# Altium project BLEFloor.PrjPcb
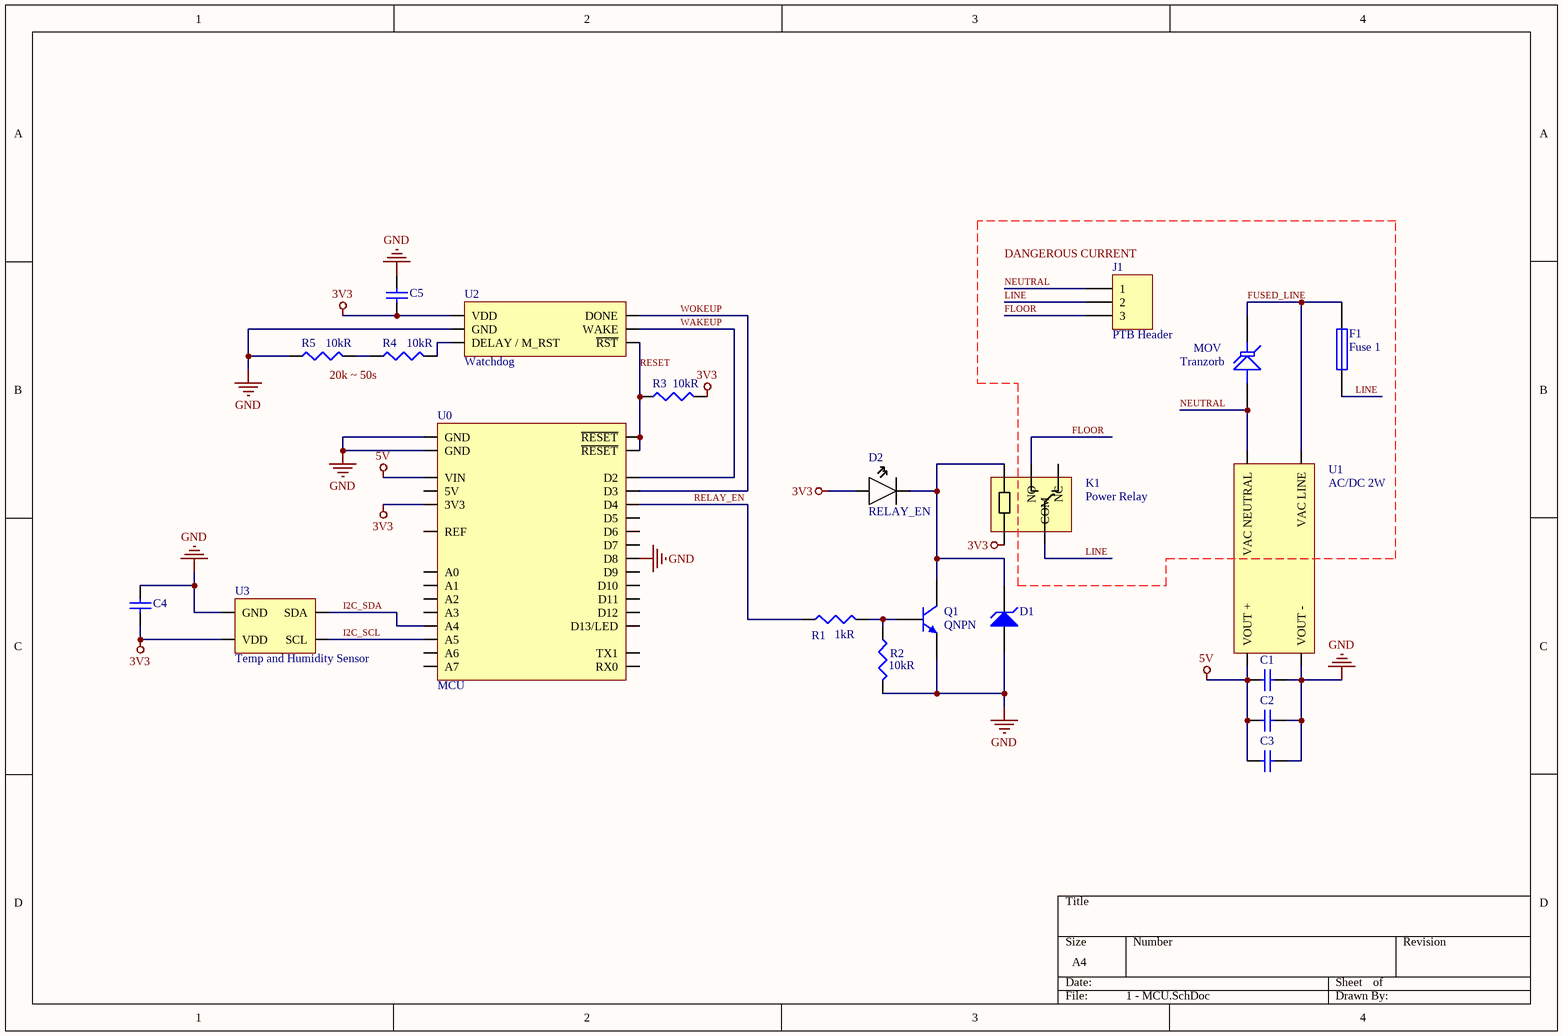
[diagram p0: 1 - MCU.SchDoc]
1 sheet, 21 parts. Net scope: global (net labels, ports and power ports of the same name join across sheets).
Board file: BLEFloor.PcbDoc

## Sheet 1 - MCU.SchDoc
size A4

### Parts
C1  4.7uF  [SMD_1206_C_SMALL]  (value not drawn)
C2  4.7uF  [SMD_1206_C_SMALL]  (value not drawn)
C3  Cap Semi  [SMD_0805_C]  (value not drawn)
C4  Cap Semi  [SMD_0805_C]  (value not drawn)
C5  Cap Semi  [SMD_0805_C]  (value not drawn)
D1  D Zener  [SOD323 / SC-76]  (value not drawn)
D2  RELAY_EN  [LED0603]
F1  Fuse 1  [Bourns SF-3812TL]
J1  PTB Header  [TBL005A-500-03GY]
K1  Power Relay  [G5LE-14]
MOV  Tranzorb  [MOV_14mm_7.5]
Q1  QNPN  [SOT-23B_N]
R1  Resistance: 1kR  [SMD_0603_R]  (hidden comment: Res3)
R2  Resistance: 10kR  [SMD_0603_R]  (hidden comment: Res3)
R3  Resistance: 10kR  [SMD_0603_R]  (hidden comment: Res3)
R4  Resistance: 10kR  [SMD_0603_R]  (hidden comment: Res3)
R5  Resistance: 10kR  [SMD_0603_R]  (hidden comment: Res3)
U0  MCU  [BLENano33IoT]
U1  AC/DC 2W  [RAC02-GA]
U2  Watchdog  [SOT23-6_L]
U3  Temp and Humidity Sensor  [3x3 6pin DFN]

### Nets
3V3: C4.2 C5.2 D2.A(ANODE) K1.5(COILB) R3.2 U0.2(3V3) U2.1(VDD) U3.5(VDD)
5V: C1.2 C2.2 C3.2 U0.15(VIN) U1.4(VOUT_+)
GND: C1.1 C2.1 C3.1 C4.1 C5.1 D1.1(A) Q1.3(E) R2.2 R5.1 U0.14(GND) U0.19(GND) U0.26(D8) U1.3(VOUT_-) U2.2(GND) U3.2(GND)
FLOOR: J1.3 K1.3(NO)
FUSED_LINE: F1.2 MOV.2(K) U1.1(VAC_LINE)
I2C_SCL: U0.9(A5) U3.6(SCL)
I2C_SDA: U0.8(A4) U3.1(SDA)
LINE: F1.1 J1.2 K1.1(COM)
NEUTRAL: J1.1 MOV.1(A) U1.2(VAC_NEUTRAL)
RELAY_EN: R1.1 U0.22(D4)
RESET: R3.1 U0.13(~{RESET}) U0.18(~{RESET}) U2.6(~{RST})
WAKEUP: U0.20(D2) U2.5(WAKE)
WOKEUP: U0.21(D3) U2.4(DONE)
NetD1_2: D1.2(K) D2.C(CATHODE) K1.2(COILA) Q1.1(C)
NetQ1_2: Q1.2(B) R1.2 R2.1
NetR4_1: R4.1 R5.2
NetR4_2: R4.2 U2.3(DELAY_/_M_RST)

Not connected (* = marked no-connect by the designer): K1 4(NC); U0 1(D13/LED) 3(REF) 4(A0) 5(A1) 6(A2) 7(A3) 10(A6) 11(A7) 12(5V) 16(TX1) 17(RX0) 23(D5) 24(D6) 25(D7) 27(D9) 28(D10) 29(D11) 30(D12)

### Notes on the sheet
- (near J1) DANGEROUS CURRENT
- 20k ~ 50s

### Library data of the parts
C1 C2 = Cap Semi: Capacitor (Semiconductor SIM Model); Manufacturer: Murata; Manufacturer Part Number: GCM31CC71H475MA03K; Supplier 1: Mouser; Supplier Part Number 1: 81-GCM31CC71H475MA3K; Stock 1: 57295; Pricing 1: 1=0.63, 10=0.448, 50=0.448, 100=0.295, 1000=0.197, 10000=0.148 (USD)
C3-C5 = Cap Semi: Manufacturer: Kyocera AVX; Manufacturer Part Number: 08055C104K4Z2A; Dielectric Material: Ceramic; Tolerance: 10%; Capacitance: 100nF; Voltage Rating: 50V; Dielectric: X7R; Temperature Coefficient: 30ppm/°C; Supplier 1: Mouser; Supplier Part Number 1: 581-08055C104K4Z2A; Stock 1: 4069; Pricing 1: 1=0.18, 10=0.137, 50=0.137, 100=0.064, 1000=0.038, 10000=0.028 (USD); Mount: Surface Mount; Case/Package: 0805; Number of Pins: 2; Case Code (Imperial): 0805; Case Code (Metric): 2012; Contact Plating: Tin,Matte; Min Operating Temperature: -55°C; Max Operating Temperature: 125°C; Packaging: Tape and Reel; Package Quantity: 1; Termination: SMD/SMT; Voltage Rating (DC): 50V; Construction: Flat; Voltage: 50V; Series: FLEXITERM®; Features: Soft Termination; Length: 2.01mm; Width: 1.25mm; Height: 0.94mm; Thickness: 0.037inch; Depth: 1.25mm; Ratings: AEC-Q200; Radiation Hardening: No; REACH SVHC: No SVHC; Lead Free: Lead Free; ComponentLink1URL: http://catalogs.avx.com/SurfaceMount.pdf?src-supplier=Digi-Key; ComponentLink1Description: http://catalogs.avx.com/SurfaceMount.pdf?src-supplier=Digi-Key; ComponentLink2URL: http://uk.rs-online.com/webdocs/13ec/0900766b813ece3d.pdf?src-supplier=RSComponents; ComponentLink2Description: http://uk.rs-online.com/webdocs/13ec/0900766b813ece3d.pdf?src-supplier=RSComponents; ComponentLink3URL: http://www.farnell.com/datasheets/630895.pdf?src-supplier=Element14; ComponentLink3Description: http://www.farnell.com/datasheets/630895.pdf?src-supplier=Element14; ComponentLink4URL: http://www.avx.com/docs/Catalogs/cauto.pdf?src-supplier=Future+Electronics; ComponentLink4Description: http://www.avx.com/docs/Catalogs/cauto.pdf?src-supplier=Future+Electronics; ComponentLink5URL: https://www.avx.com/docs/Catalogs/flexiterm.pdf?src-supplier=Avnet; ComponentLink5Description: https://www.avx.com/docs/Catalogs/flexiterm.pdf?src-supplier=Avnet; ComponentLink6URL: http://www.farnell.com/datasheets/2237835.pdf?src-supplier=Element14; ComponentLink6Description: http://www.farnell.com/datasheets/2237835.pdf?src-supplier=Element14
D1 = D Zener: TVS DIODE 3.3VWM 13VC; pin to pad: 1>2 2>1; Manufacturer: Nexperia; Manufacturer Part Number: BZX384-B3V3,115; Supplier 1: Mouser; Supplier Part Number 1: 771-BZX384-B3V3-T/R; Stock 1: 20536; Pricing 1: 1=0.2, 10=0.127, 50=0.127, 100=0.065, 1000=0.039, 10000=0.025 (USD); ComponentLink1URL: http://www.farnell.com/datasheets/2174101.pdf?src-supplier=Farnell; ComponentLink1Description: http://www.farnell.com/datasheets/2174101.pdf?src-supplier=Farnell; ComponentLink2URL: https://assets.nexperia.com/documents/data-sheet/BZX384_SERIES.pdf?src-supplier=Digi-Key; ComponentLink2Description: https://assets.nexperia.com/documents/data-sheet/BZX384_SERIES.pdf?src-supplier=Digi-Key
D2 = LED: Manufacturer: Stanley Electric; Manufacturer Part Number: SJW1151CKS-100-TR; Color: Orange; Lens Style: Flat; Luminous Intensity: 280mcd; Forward Voltage: 3.2V; Test Current: 20mA; Viewing Angle: 165°; Lens Size: 0.8mm; Supplier 1: Mouser; Supplier Part Number 1: 327-SJW1151CKS100TR; Stock 1: 7869; Pricing 1: 1=0.6, 10=0.395, 50=0.395, 100=0.258, 1000=0.204, 10000=0.167 (USD); Mount: Surface Mount; Case/Package: 0603; Lens Color: Orange; Case Code (Imperial): 0603; Case Code (Metric): 1608; Packaging: Tape and Reel; Length: 1.6mm; Width: 0.8mm; Height: 0.8mm; ComponentLink1URL: http://www.stanley-components.com/php/downloaddatafile.php?rp=0,SJW1151CKS-100_e.pdf&src-supplier=Digi-Key; ComponentLink1Description: http://www.stanley-components.com/php/downloaddatafile.php?rp=0,SJW1151CKS-100_e.pdf&src-supplier=Digi-Key
F1 = Fuse 1: Fuse; Manufacturer: Bourns; Manufacturer Part Number: SF-3812TL050T-2; Supplier 1: Mouser; Supplier Part Number 1: 652-SF-3812TL050T-2; Stock 1: 4734; Pricing 1: 1=1.47, 10=1.37, 50=1.13, 100=0.961, 1000=0.711, 10000=0.674 (USD)
J1 = Header 3: Header, 3-Pin; Manufacturer: CUI Devices; Manufacturer Part Number: TBL005A-500-03GY-2WT; LatestRevisionDate: 17-Jul-2002; LatestRevisionNote: Re-released for DXP Platform.; Publisher: Altium Limited; Supplier 1: Mouser; Supplier Part Number 1: 490-TBL05A50003GY2WT; Stock 1: 434; Pricing 1: 1=1.11, 10=0.664, 50=0.664, 100=0.558, 1000=0.47, 10000=0.426 (USD)
K1 = Relay, SPDT: Manufacturer: Omron; Manufacturer Part Number: G5LE-14-DC3; Throw Configuration: SPDT; Coil Resistance: 22.5R; Coil Current: 133mA; Operate Time: 10ms; Release Time: 5ms; Coil Power: 400mW; Max Voltage Rating (AC): 250V; Max Voltage Rating (DC): 125V; Relay Type: General Purpose; Coil Type: Non-Latching; Coil Voltage (DC): 3V; Contact Current Rating: 10A; Supplier 1: Mouser; Supplier Part Number 1: 653-G5LE-14DC3; Stock 1: 0; Pricing 1: 1=1.24, 10=1.14, 50=1.14, 100=0.92, 1000=0.865, 10000=0.834 (USD); Mount: Through Hole; Number of Pins: 5; Contact Material: Tin,Silver; Weight: 12g; Min Operating Temperature: -25°C; Max Operating Temperature: 85°C; Package Quantity: 500; Packaging: Tray; Termination: PC Pin; Max Current Rating: 10A; Series: G5LE; Radiation Hardening: No; ComponentLink1URL: https://omronfs.omron.com/en_US/ecb/products/pdf/en-g5le.pdf?src-supplier=Digi-Key; ComponentLink1Description: https://omronfs.omron.com/en_US/ecb/products/pdf/en-g5le.pdf?src-supplier=Digi-Key
MOV = Tranzorb: Transient Voltage Suppression (TVS) Diode; Manufacturer: Bourns; Manufacturer Part Number: MOV-14D391K; Capacitance: 510pF; Max Voltage Rating (DC): 320V; Max Voltage Rating (AC): 250V; Clamping Current: 50A; Varistor Voltage: 390V; Max Surge Current: 4.5kA; Tolerance: 10%; Number of Circuits: 1; Energy: 100J; Clamping Voltage: 650V; Min Varistor Voltage: 351V; Max Varistor Voltage: 429V; Lead/Base Style: Radial; Power Rating: 600mW; Supplier 1: Mouser; Supplier Part Number 1: 652-MOV-14D391K; Stock 1: 3937; Pricing 1: 1=0.47, 10=0.309, 50=0.309, 100=0.252, 1000=0.129, 10000=0.108 (USD); Mount: Through Hole,Radial; Case/Package: Metal; Weight: 0.105822oz; Min Operating Temperature: -40°C; Max Operating Temperature: 85°C; Package Quantity: 1000; Packaging: Bulk; Voltage Rating (AC): 250V; Voltage Rating (DC): 320V; Current Rating: 50A; Voltage Tolerance: 10%; Series: 14D; Diameter: 14mm; Lead Pitch: 7.5mm; Depth: 5mm; Thickness: 5mm; Radiation Hardening: No; REACH SVHC: No SVHC; ComponentLink1URL: https://media.digikey.com/pdf/Data%20Sheets/Bourns%20PDFs/MOV14D_MOV20D_PB.pdf?src-supplier=Digi-Key; ComponentLink1Description: https://media.digikey.com/pdf/Data%20Sheets/Bourns%20PDFs/MOV14D_MOV20D_PB.pdf?src-supplier=Digi-Key; ComponentLink2URL: http://www.bourns.com/data/global/pdfs/MOV14D.pdf?src-supplier=Avnet; ComponentLink2Description: http://www.bourns.com/data/global/pdfs/MOV14D.pdf?src-supplier=Avnet; ComponentLink3URL: http://www.farnell.com/datasheets/1730506.pdf?src-supplier=Element14; ComponentLink3Description: http://www.farnell.com/datasheets/1730506.pdf?src-supplier=Element14
Q1 = QNPN: TRANS NPN MED PWR 400V SOT23F-3; pin to pad: 1>3 2>1 3>2; Manufacturer: Diodes; Manufacturer Part Number: BC847A-7-F; Max Power Dissipation: 300mW; Collector Emitter Voltage (VCEO): 45V; Max Collector Current: 100mA; Transition Frequency: 300MHz; Power Dissipation: 350mW; Collector-emitter Voltage-Max: 600mV; Number of Elements: 1; Collector Base Voltage (VCBO): 50V; Emitter Base Voltage (VEBO): 6V; Element Configuration: Single; hFE Min: 110; Supplier 1: Mouser; Supplier Part Number 1: 621-BC847A-7-F; Stock 1: 3196; Pricing 1: 1=0.19, 10=0.164, 50=0.164, 100=0.073, 1000=0.04, 10000=0.026 (USD); Mount: Surface Mount; Case/Package: SOT-23; Number of Pins: 3; Weight: 0.000282oz; Contact Plating: Tin,Matte; Min Operating Temperature: -65°C; Max Operating Temperature: 150°C; Packaging: Tape and Reel; Collector Emitter Breakdown Voltage: 45V; Max Breakdown Voltage: 45V; Polarity: NPN; Package Quantity: 3000; Frequency: 300MHz; Gain Bandwidth Product: 300MHz; Series: -; Collector Emitter Saturation Voltage: 600mV; Max Frequency: 300MHz; Termination: SMD/SMT; Length: 3.05mm; Width: 1.4mm; Height: 1mm; REACH SVHC: No SVHC; Lead Free: Lead Free; ComponentLink1URL: http://www.diodes.com///datasheets/ds11108.pdf?src-supplier=Avnet+Europe; ComponentLink1Description: http://www.diodes.com///datasheets/ds11108.pdf?src-supplier=Avnet+Europe
R1 = Res3: RES 1K OHM 1/10W 1% 0603 SMD; Manufacturer: Panasonic; Manufacturer Part Number: ERJ3EKF1001V; Temperature Coefficient: 100ppm/°C; Power Rating: 100mW; Voltage Rating: 75V; Supplier 1: Mouser; Supplier Part Number 1: 667-ERJ-3EKF1001V; Stock 1: 482289; Pricing 1: 1=0.1, 10=0.032, 50=0.032, 100=0.013, 1000=0.006, 10000=0.006 (USD); Mount: Surface Mount; Case/Package: 0603; Number of Pins: 2; Contact Plating: Tin; Case Code (Metric): 1608; Case Code (Imperial): 0603; Size Code: 0603; Min Operating Temperature: -55°C; Max Operating Temperature: 155°C; Tolerance: 1%; Resistor Type: Thick Film; Packaging: Tape and Reel; Package Quantity: 5000; Number of Terminations: 2; Termination: SMD/SMT; Max Power Dissipation: 100mW; Voltage Rating (DC): 75V; Features: Automotive AEC-Q200; Series: ERJ; Technology: THICK FILM; Construction: Rectangular; Resistance Tolerance: 1%; Length: 1.6mm; Width: 0.8mm; Height: 0.45mm; Depth: 0.8mm; Radiation Hardening: No; REACH SVHC: No SVHC; Military Standard: Not; Lead Free: Lead Free; ComponentLink1URL: http://www.farnell.com/datasheets/1911175.pdf?src-supplier=Allied+Electronics; ComponentLink1Description: http://www.farnell.com/datasheets/1911175.pdf?src-supplier=Allied+Electronics; ComponentLink2URL: http://industrial.panasonic.com/www-data/pdf/AOA0000/AOA0000CE2.pdf?src-supplier=Future+Electronics; ComponentLink2Description: http://industrial.panasonic.com/www-data/pdf/AOA0000/AOA0000CE2.pdf?src-supplier=Future+Electronics; ComponentLink3URL: http://industrial.panasonic.com/www-data/pdf/AOA0000/AOA0000CE2.pdf?src-supplier=Element14; ComponentLink3Description: http://industrial.panasonic.com/www-data/pdf/AOA0000/AOA0000CE2.pdf?src-supplier=Element14; ComponentLink4URL: http://industrial.panasonic.com/www-data/pdf/AOA0000/AOA0000CE2.pdf?src-supplier=Avnet; ComponentLink4Description: http://industrial.panasonic.com/www-data/pdf/AOA0000/AOA0000CE2.pdf?src-supplier=Avnet; ComponentLink5URL: http://industrial.panasonic.com/cdbs/www-data/pdf/RDA0000/AOA0000C304.pdf?src-supplier=Element14; ComponentLink5Description: http://industrial.panasonic.com/cdbs/www-data/pdf/RDA0000/AOA0000C304.pdf?src-supplier=Element14; ComponentLink6URL: http://www.mouser.com/ds/2/315/AOA0000CE2-37512.pdf?src-supplier=Mouser; ComponentLink6Description: http://www.mouser.com/ds/2/315/AOA0000CE2-37512.pdf?src-supplier=Mouser; ComponentLink7URL: http://www.farnell.com/datasheets/1678782.pdf?src-supplier=Element14; ComponentLink7Description: http://www.farnell.com/datasheets/1678782.pdf?src-supplier=Element14; ComponentLink8URL: http://industrial.panasonic.com/www-data/pdf/AOA0000/AOA0000CE2.pdf?src-supplier=Avnet+Europe; ComponentLink8Description: http://industrial.panasonic.com/www-data/pdf/AOA0000/AOA0000CE2.pdf?src-supplier=Avnet+Europe
R2-R5 = Res3: RES 10K OHM 1/10W 1% 0603 SMD; Manufacturer: Panasonic; Manufacturer Part Number: ERJ-3EKF1002V; Temperature Coefficient: 100ppm/°C; Power Rating: 100mW; Voltage Rating: 75V; Supplier 1: Mouser; Supplier Part Number 1: 667-ERJ-3EKF1002V; Stock 1: 2013101; Pricing 1: 1=0.1, 10=0.04, 50=0.04, 100=0.017, 1000=0.008, 10000=0.003 (USD); Mount: Surface Mount; Case/Package: 0603; Number of Pins: 2; Contact Plating: Tin; Case Code (Metric): 1608; Case Code (Imperial): 0603; Size Code: 0603; Min Operating Temperature: -55°C; Max Operating Temperature: 155°C; Tolerance: 1%; Resistor Type: Thick Film; Packaging: Tape and Reel; Package Quantity: 1; Number of Terminations: 2; Termination: SMD/SMT; Max Power Dissipation: 100mW; Voltage Rating (DC): 75V; Features: Automotive AEC-Q200; Series: ERJ; Technology: THICK FILM; Resistance Tolerance: 1%; Construction: Rectangular; Length: 1.6mm; Width: 0.031inch; Height: 0.45mm; Depth: 0.8mm; Radiation Hardening: No; REACH SVHC: No SVHC; Military Standard: Not; Lead Free: Lead Free; ComponentLink1URL: https://industrial.panasonic.com/cdbs/www-data/pdf/RDA0000/DMA0000COL11.pdf?src-supplier=Avnet+Asia; ComponentLink1Description: https://industrial.panasonic.com/cdbs/www-data/pdf/RDA0000/DMA0000COL11.pdf?src-supplier=Avnet+Asia; ComponentLink2URL: http://www.farnell.com/datasheets/1911175.pdf?src-supplier=Element14; ComponentLink2Description: http://www.farnell.com/datasheets/1911175.pdf?src-supplier=Element14; ComponentLink3URL: https://industrial.panasonic.com/cdbs/www-data/pdf/RDA0000/DMA0000COL11.pdf?src-supplier=Avnet; ComponentLink3Description: https://industrial.panasonic.com/cdbs/www-data/pdf/RDA0000/DMA0000COL11.pdf?src-supplier=Avnet; ComponentLink4URL: http://industrial.panasonic.com/www-data/pdf/AOA0000/AOA0000CE2.pdf?src-supplier=Avnet+Europe; ComponentLink4Description: http://industrial.panasonic.com/www-data/pdf/AOA0000/AOA0000CE2.pdf?src-supplier=Avnet+Europe; ComponentLink5URL: http://industrial.panasonic.com/www-data/pdf/AOA0000/AOA0000CE2.pdf?src-supplier=Avnet; ComponentLink5Description: http://industrial.panasonic.com/www-data/pdf/AOA0000/AOA0000CE2.pdf?src-supplier=Avnet; ComponentLink6URL: https://industrial.panasonic.com/cdbs/www-data/pdf/RDA0000/DMA0000COL11.pdf?src-supplier=Mouser; ComponentLink6Description: https://industrial.panasonic.com/cdbs/www-data/pdf/RDA0000/DMA0000COL11.pdf?src-supplier=Mouser; ComponentLink7URL: https://industrial.panasonic.com/cdbs/www-data/pdf/RDA0000/DMA0000COL11.pdf?src-supplier=Allied+Electronics; ComponentLink7Description: https://industrial.panasonic.com/cdbs/www-data/pdf/RDA0000/DMA0000COL11.pdf?src-supplier=Allied+Electronics
U0 = ArduinoNano33IoT
U1 = ADDC Wandler: Manufacturer: Recom; Manufacturer Part Number: RAC02-05SGA; Max Output Voltage: 5V; Number of Outputs: 1; Max Output Current: 400mA; Efficiency: 69%; Approvals: CE,cURus; Supplier 1: Mouser; Supplier Part Number 1: 919-RAC02-05SGA; Stock 1: 141; Pricing 1: 1=6.74, 10=6.55, 50=5.98, 100=5.79, 1000=5.23, 10000=5.23 (USD); Mount: Through Hole; Weight: 12g; Min Operating Temperature: -25°C; Max Operating Temperature: 70°C; Voltage - Output 1: 5V; Max Power Dissipation: 2W; Length: 33.7mm; Width: 22.2mm; Height: 19mm; ComponentLink1URL: http://www.farnell.com/datasheets/2787655.pdf?src-supplier=Farnell; ComponentLink1Description: http://www.farnell.com/datasheets/2787655.pdf?src-supplier=Farnell; ComponentLink2URL: https://www.recom-power.com/pdf/Powerline-AC-DC/RAC02-GA.pdf?src-supplier=Digi-Key; ComponentLink2Description: https://www.recom-power.com/pdf/Powerline-AC-DC/RAC02-GA.pdf?src-supplier=Digi-Key
U2 = TPL5010: Manufacturer: Texas Instruments; Manufacturer Part Number: TPL5010DDCR; Quiescent Current: 35nA; Number of Timers/Counters: 1; Low Level Output Current: 1mA; High Level Output Current: -1mA; Supplier 1: Mouser; Supplier Part Number 1: 595-TPL5010DDCR; Stock 1: 160419; Pricing 1: 1=0.9, 10=0.738, 50=0.738, 100=0.56, 1000=0.381, 10000=0.31 (USD); Mount: Surface Mount; Case/Package: SOT-23-6; Number of Pins: 6; Weight: 0.00127oz; Contact Plating: Gold; Min Operating Temperature: -40°C; Max Operating Temperature: 105°C; Packaging: Tape and Reel; Package Quantity: 3000; Lead Free: Lead Free; ComponentLink1URL: http://www.ti.com/lit/gpn/TPL5010?src-supplier=Mouser; ComponentLink1Description: http://www.ti.com/lit/gpn/TPL5010?src-supplier=Mouser; ComponentLink2URL: http://www.ti.com/general/docs/lit/getliterature.tsp?genericPartNumber=TPL5010&&fileType=pdf&src-supplier=Avnet+Asia; ComponentLink2Description: http://www.ti.com/general/docs/lit/getliterature.tsp?genericPartNumber=TPL5010&&fileType=pdf&src-supplier=Avnet+Asia; ComponentLink3URL: http://www.ti.com/lit/ds/symlink/tpl5010.pdf?src-supplier=Digi-Key; ComponentLink3Description: http://www.ti.com/lit/ds/symlink/tpl5010.pdf?src-supplier=Digi-Key; ComponentLink4URL: http://www.ti.com/general/docs/lit/getliterature.tsp?genericPartNumber=TPL5010&&fileType=pdf&src-supplier=Avnet; ComponentLink4Description: http://www.ti.com/general/docs/lit/getliterature.tsp?genericPartNumber=TPL5010&&fileType=pdf&src-supplier=Avnet
U3 = Si7020: Manufacturer: Silicon Labs; Manufacturer Part Number: SI7020-A20-GM; Response Time: 18s; Accuracy: 4%; Sensor Type: Temperature; Output Type: I2C,Digital; Interface: I2C; Min Supply Voltage: 1.9V; Max Supply Voltage: 3.6V; Supplier 1: Mouser; Supplier Part Number 1: 634-SI7020-A20-GM; Stock 1: 198; Pricing 1: 1=2.48, 10=2.43, 50=2.33, 100=2.29, 1000=2.18, 10000=2.18 (USD); Mount: Surface Mount; Case/Package: DFN; Number of Pins: 6; Min Operating Temperature: -40°C; Max Operating Temperature: 85°C; Length: 3mm; Width: 3mm; Height: 0.75mm; REACH SVHC: Unknown; ComponentLink1URL: https://www.silabs.com/Support%20Documents%2fTechnicalDocs%2fSi7020-A20.pdf?src-supplier=Digi-Key; ComponentLink1Description: https://www.silabs.com/Support%20Documents%2fTechnicalDocs%2fSi7020-A20.pdf?src-supplier=Digi-Key; ComponentLink2URL: https://www.silabs.com/Support%20Documents/TechnicalDocs/Si7020-A20.pdf?src-supplier=Avnet+Asia; ComponentLink2Description: https://www.silabs.com/Support%20Documents/TechnicalDocs/Si7020-A20.pdf?src-supplier=Avnet+Asia; ComponentLink3URL: https://www.silabs.com/Support%20Documents/TechnicalDocs/Si7020-A20.pdf?src-supplier=Avnet; ComponentLink3Description: https://www.silabs.com/Support%20Documents/TechnicalDocs/Si7020-A20.pdf?src-supplier=Avnet; ComponentLink4URL: http://www.farnell.com/datasheets/1902512.pdf?src-supplier=Element14; ComponentLink4Description: http://www.farnell.com/datasheets/1902512.pdf?src-supplier=Element14; ComponentLink5URL: http://www.farnell.com/datasheets/2245065.pdf?src-supplier=Farnell; ComponentLink5Description: http://www.farnell.com/datasheets/2245065.pdf?src-supplier=Farnell